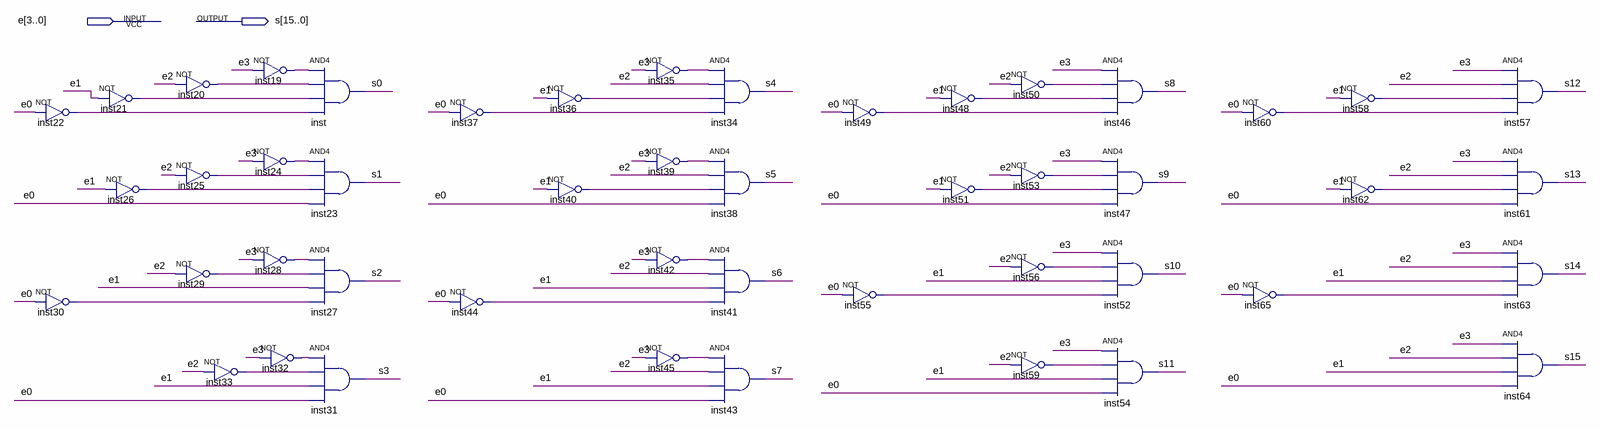
[diagram p0: schematic sheet]
// Quartus schematic jpd_decod_4x16.bdf as structural Verilog: 48 symbols, 2 pins
module jpd_decod_4x16 (
  input  [3:0] e,
  output [15:0] s
);

  wire inst19_out, inst20_out, inst21_out, inst22_out, inst24_out, inst25_out, inst26_out, inst28_out,
       inst29_out, inst30_out, inst32_out, inst33_out, inst35_out, inst36_out, inst37_out, inst39_out,
       inst40_out, inst42_out, inst44_out, inst45_out, inst48_out, inst49_out, inst50_out, inst51_out,
       inst53_out, inst55_out, inst56_out, inst58_out, inst59_out, inst60_out, inst62_out, inst65_out;

  not inst22 (inst22_out, e[0]);
  not inst30 (inst30_out, e[0]);
  not inst21 (inst21_out, e[1]);
  not inst26 (inst26_out, e[1]);
  not inst20 (inst20_out, e[2]);
  not inst25 (inst25_out, e[2]);
  not inst29 (inst29_out, e[2]);
  not inst33 (inst33_out, e[2]);
  not inst19 (inst19_out, e[3]);
  not inst24 (inst24_out, e[3]);
  not inst28 (inst28_out, e[3]);
  not inst32 (inst32_out, e[3]);
  and inst (s[0], inst19_out, inst20_out, inst21_out, inst22_out);
  and inst23 (s[1], inst24_out, inst25_out, inst26_out, e[0]);
  and inst27 (s[2], inst28_out, inst29_out, e[1], inst30_out);
  and inst31 (s[3], inst32_out, inst33_out, e[1], e[0]);
  not inst37 (inst37_out, e[0]);
  not inst44 (inst44_out, e[0]);
  not inst36 (inst36_out, e[1]);
  not inst40 (inst40_out, e[1]);
  not inst35 (inst35_out, e[3]);
  not inst39 (inst39_out, e[3]);
  not inst42 (inst42_out, e[3]);
  not inst45 (inst45_out, e[3]);
  and inst34 (s[4], inst35_out, e[2], inst36_out, inst37_out);
  and inst38 (s[5], inst39_out, e[2], inst40_out, e[0]);
  and inst41 (s[6], inst42_out, e[2], e[1], inst44_out);
  and inst43 (s[7], inst45_out, e[2], e[1], e[0]);
  not inst49 (inst49_out, e[0]);
  not inst55 (inst55_out, e[0]);
  not inst48 (inst48_out, e[1]);
  not inst51 (inst51_out, e[1]);
  not inst50 (inst50_out, e[2]);
  not inst53 (inst53_out, e[2]);
  not inst56 (inst56_out, e[2]);
  not inst59 (inst59_out, e[2]);
  and inst46 (s[8], e[3], inst50_out, inst48_out, inst49_out);
  and inst47 (s[9], e[3], inst53_out, inst51_out, e[0]);
  and inst52 (s[10], e[3], inst56_out, e[1], inst55_out);
  and inst54 (s[11], e[3], inst59_out, e[1], e[0]);
  not inst60 (inst60_out, e[0]);
  not inst65 (inst65_out, e[0]);
  not inst58 (inst58_out, e[1]);
  not inst62 (inst62_out, e[1]);
  and inst57 (s[12], e[3], e[2], inst58_out, inst60_out);
  and inst61 (s[13], e[3], e[2], inst62_out, e[0]);
  and inst63 (s[14], e[3], e[2], e[1], inst65_out);
  and inst64 (s[15], e[3], e[2], e[1], e[0]);
endmodule
